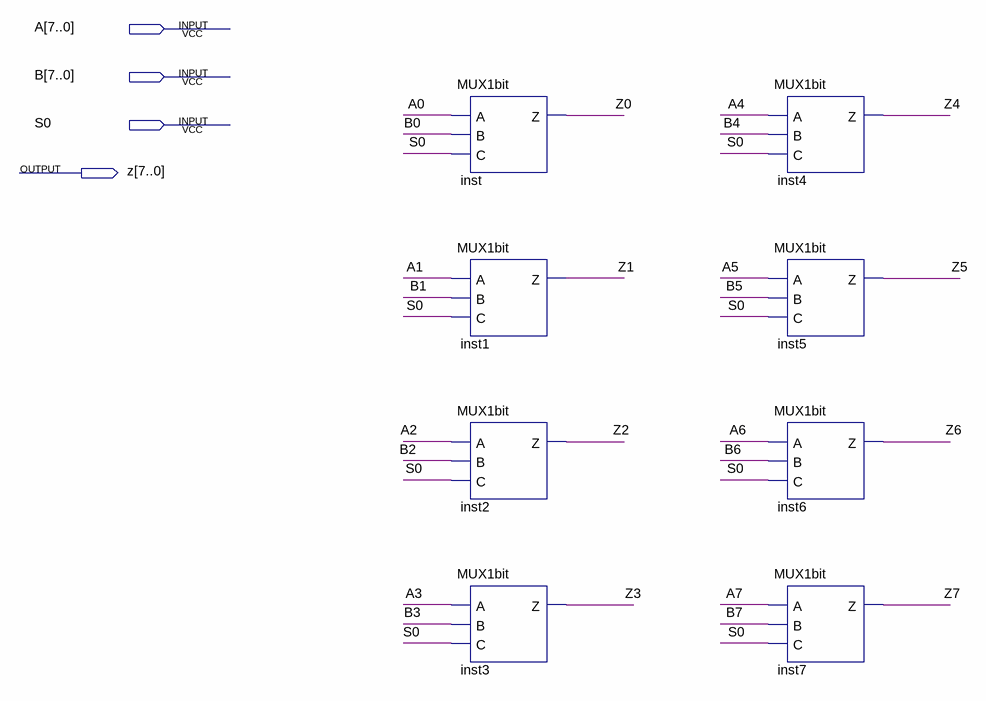
[diagram p0: schematic sheet]
// Quartus schematic MUX8bits.bdf as structural Verilog: 8 symbols, 4 pins
module MUX8bits (
  input  [7:0] A,
  input  [7:0] B,
  input  S0,
  output [7:0] z
);

  MUX1bit inst (.A(A[0]), .B(B[0]), .C(S0), .Z(z[0]));
  MUX1bit inst1 (.A(A[1]), .B(B[1]), .C(S0), .Z(z[1]));
  MUX1bit inst2 (.A(A[2]), .B(B[2]), .C(S0), .Z(z[2]));
  MUX1bit inst3 (.A(A[3]), .B(B[3]), .C(S0), .Z(z[3]));
  MUX1bit inst4 (.A(A[4]), .B(B[4]), .C(S0), .Z(z[4]));
  MUX1bit inst5 (.A(A[5]), .B(B[5]), .C(S0), .Z(z[5]));
  MUX1bit inst6 (.A(A[6]), .B(B[6]), .C(S0), .Z(z[6]));
  MUX1bit inst7 (.A(A[7]), .B(B[7]), .C(S0), .Z(z[7]));
endmodule
